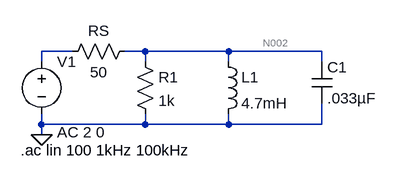
[diagram p0: schematic RLC_Parallel_Circuit.asc]
RLC_Parallel_Circuit.asc, the LTspice schematic file:
Version 4
SHEET 1 880 680
WIRE 16 128 -32 128
WIRE 128 128 96 128
WIRE 256 128 128 128
WIRE 400 128 256 128
WIRE -32 144 -32 128
WIRE 128 144 128 128
WIRE 256 144 256 128
WIRE 400 144 400 128
WIRE -32 240 -32 224
WIRE 128 240 128 224
WIRE 128 240 -32 240
WIRE 256 240 256 224
WIRE 256 240 128 240
WIRE 400 240 400 208
WIRE 400 240 256 240
WIRE -32 256 -32 240
FLAG -32 256 0
SYMBOL voltage -32 128 R0
WINDOW 123 24 124 Left 2
WINDOW 39 0 0 Left 0
SYMATTR InstName V1
SYMATTR Value ""
SYMATTR Value2 AC 2 0
SYMBOL res 112 128 R0
SYMATTR InstName R1
SYMATTR Value 1k
SYMBOL ind 240 128 R0
SYMATTR InstName L1
SYMATTR Value 4.7mH
SYMBOL cap 384 144 R0
SYMATTR InstName C1
SYMATTR Value .033µF
SYMBOL res 0 144 R270
WINDOW 0 32 56 VTop 2
WINDOW 3 0 56 VBottom 2
SYMATTR InstName RS
SYMATTR Value 50
TEXT -64 280 Left 2 !.ac lin 100 1kHz 100kHz

The netlist it stands for:
* RLC_Parallel_Circuit.asc
V1 N001 0 AC 2 0
R1 N002 0 1k
L1 N002 0 4.7mH
C1 N002 0 .033µF
RS N001 N002 50
.ac lin 100 1kHz 100kHz
.backanno
.end

* Results of the author's LTspice run, read from the files saved beside the schematic
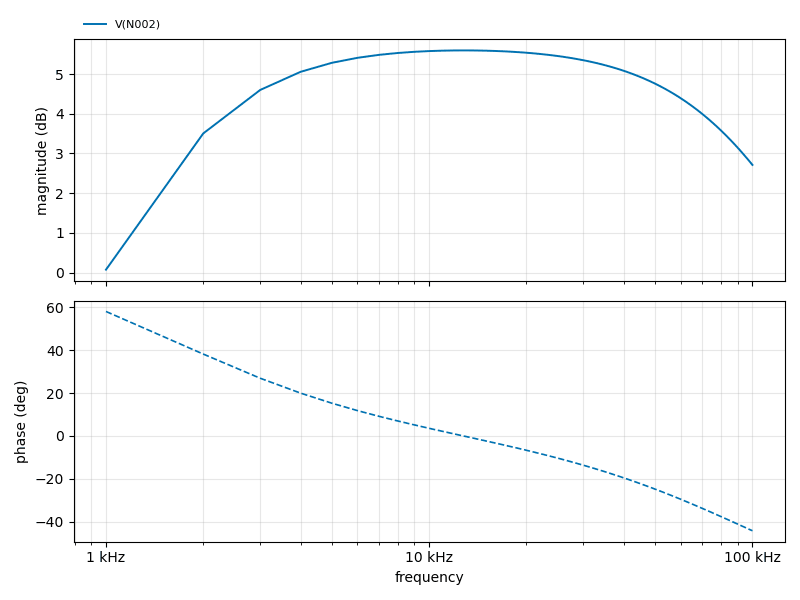
[diagram p1: AC Analysis of RLC_Parallel_Circuit.asc, plotted from the saved traces]
* AC Analysis, 1 run:
*   V(N002): 0.07 dB at 1 kHz, 2.71 dB at 100 kHz, peak 5.60 dB at 13 kHz, 3 dB below the peak at 1.661 kHz